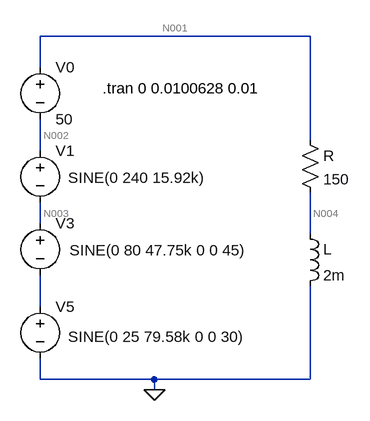
[diagram p0: schematic Three-harmonic-signal_2.asc]
Three-harmonic-signal_2.asc, the LTspice schematic file:
Version 4
SHEET 1 880 680
WIRE 448 -144 32 -144
WIRE 32 -96 32 -144
WIRE 448 16 448 -144
WIRE 32 32 32 -16
WIRE 32 144 32 112
WIRE 448 160 448 96
WIRE 32 272 32 224
WIRE 32 384 32 352
WIRE 208 384 32 384
WIRE 448 384 448 240
WIRE 448 384 208 384
WIRE 208 400 208 384
FLAG 208 400 0
SYMBOL voltage 32 16 R0
WINDOW 3 43 58 Left 2
WINDOW 123 0 0 Left 0
WINDOW 39 0 0 Left 0
SYMATTR Value SINE(0 240 15.92k)
SYMATTR InstName V1
SYMBOL voltage 32 128 R0
WINDOW 3 45 57 Left 2
WINDOW 123 0 0 Left 0
WINDOW 39 0 0 Left 0
SYMATTR Value SINE(0 80 47.75k 0 0 45)
SYMATTR InstName V3
SYMBOL voltage 32 256 R0
WINDOW 3 43 62 Left 2
WINDOW 123 0 0 Left 0
WINDOW 39 0 0 Left 0
SYMATTR Value SINE(0 25 79.58k 0 0 30)
SYMATTR InstName V5
SYMBOL res 432 0 R0
SYMATTR InstName R
SYMATTR Value 150
SYMBOL voltage 32 -112 R0
WINDOW 123 0 0 Left 0
WINDOW 39 0 0 Left 0
SYMATTR InstName V0
SYMATTR Value 50
SYMBOL ind 432 144 R0
SYMATTR InstName L
SYMATTR Value 2m
TEXT 128 -64 Left 2 !.tran 0 0.0100628 0.01

The netlist it stands for:
* Three-harmonic-signal_2.asc
V1 N002 N003 SINE(0 240 15.92k)
V3 N003 N005 SINE(0 80 47.75k 0 0 45)
V5 N005 0 SINE(0 25 79.58k 0 0 30)
R N001 N004 150
V0 N001 N002 50
L N004 0 2m
.tran 0 0.0100628 0.01
.backanno
.end

* Results of the author's LTspice run, read from the files saved beside the schematic
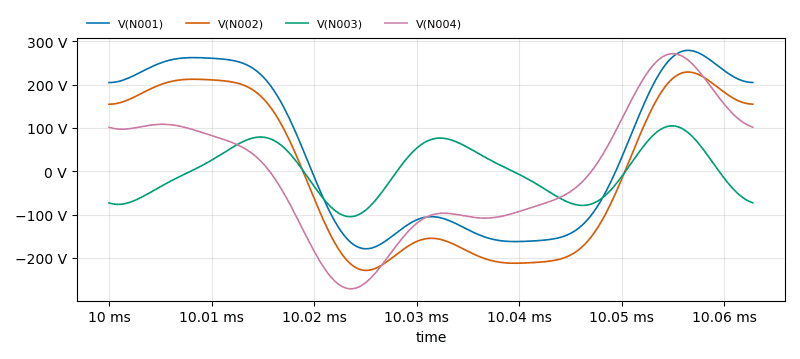
[diagram p1: Transient Analysis of Three-harmonic-signal_2.asc, plotted from the saved traces]
* Transient Analysis, 1 run:
*   V(N001): min -179.2 V, max 279.4 V, average 49.98 V, rms 186.6 V, last 205 V
*   V(N002): min -229.2 V, max 229.4 V, average -18.75 mV, rms 179.8 V, last 155 V
*   V(N003): min -104.9 V, max 105 V, average 32.37 mV, rms 59.26 V, last -73.11 V
*   V(N004): min -271.7 V, max 271.8 V, average 13.15 mV, rms 147.5 V, last 101.6 V